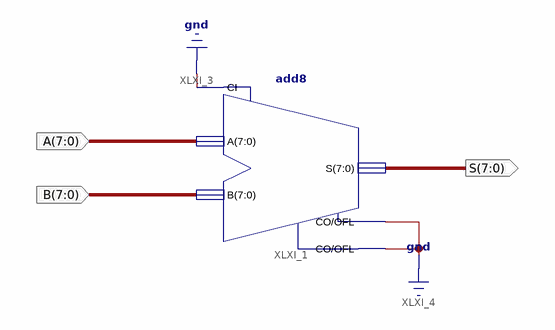
[diagram p0: schematic sheet 1]
// Xilinx ISE schematic ADD.sch (spartan6) as structural Verilog: 1 symbols, 3 ports
module ADD (
  input  [7:0] A,
  input  [7:0] B,
  output [7:0] S
);

  add8 XLXI_1 (.A(A), .B(B), .CI(1'b0), .CO(1'b0), .OFL(1'b0), .S(S));
endmodule
